# EAGLE schematic EVmulator_T85 (EAGLE 9.6.2)
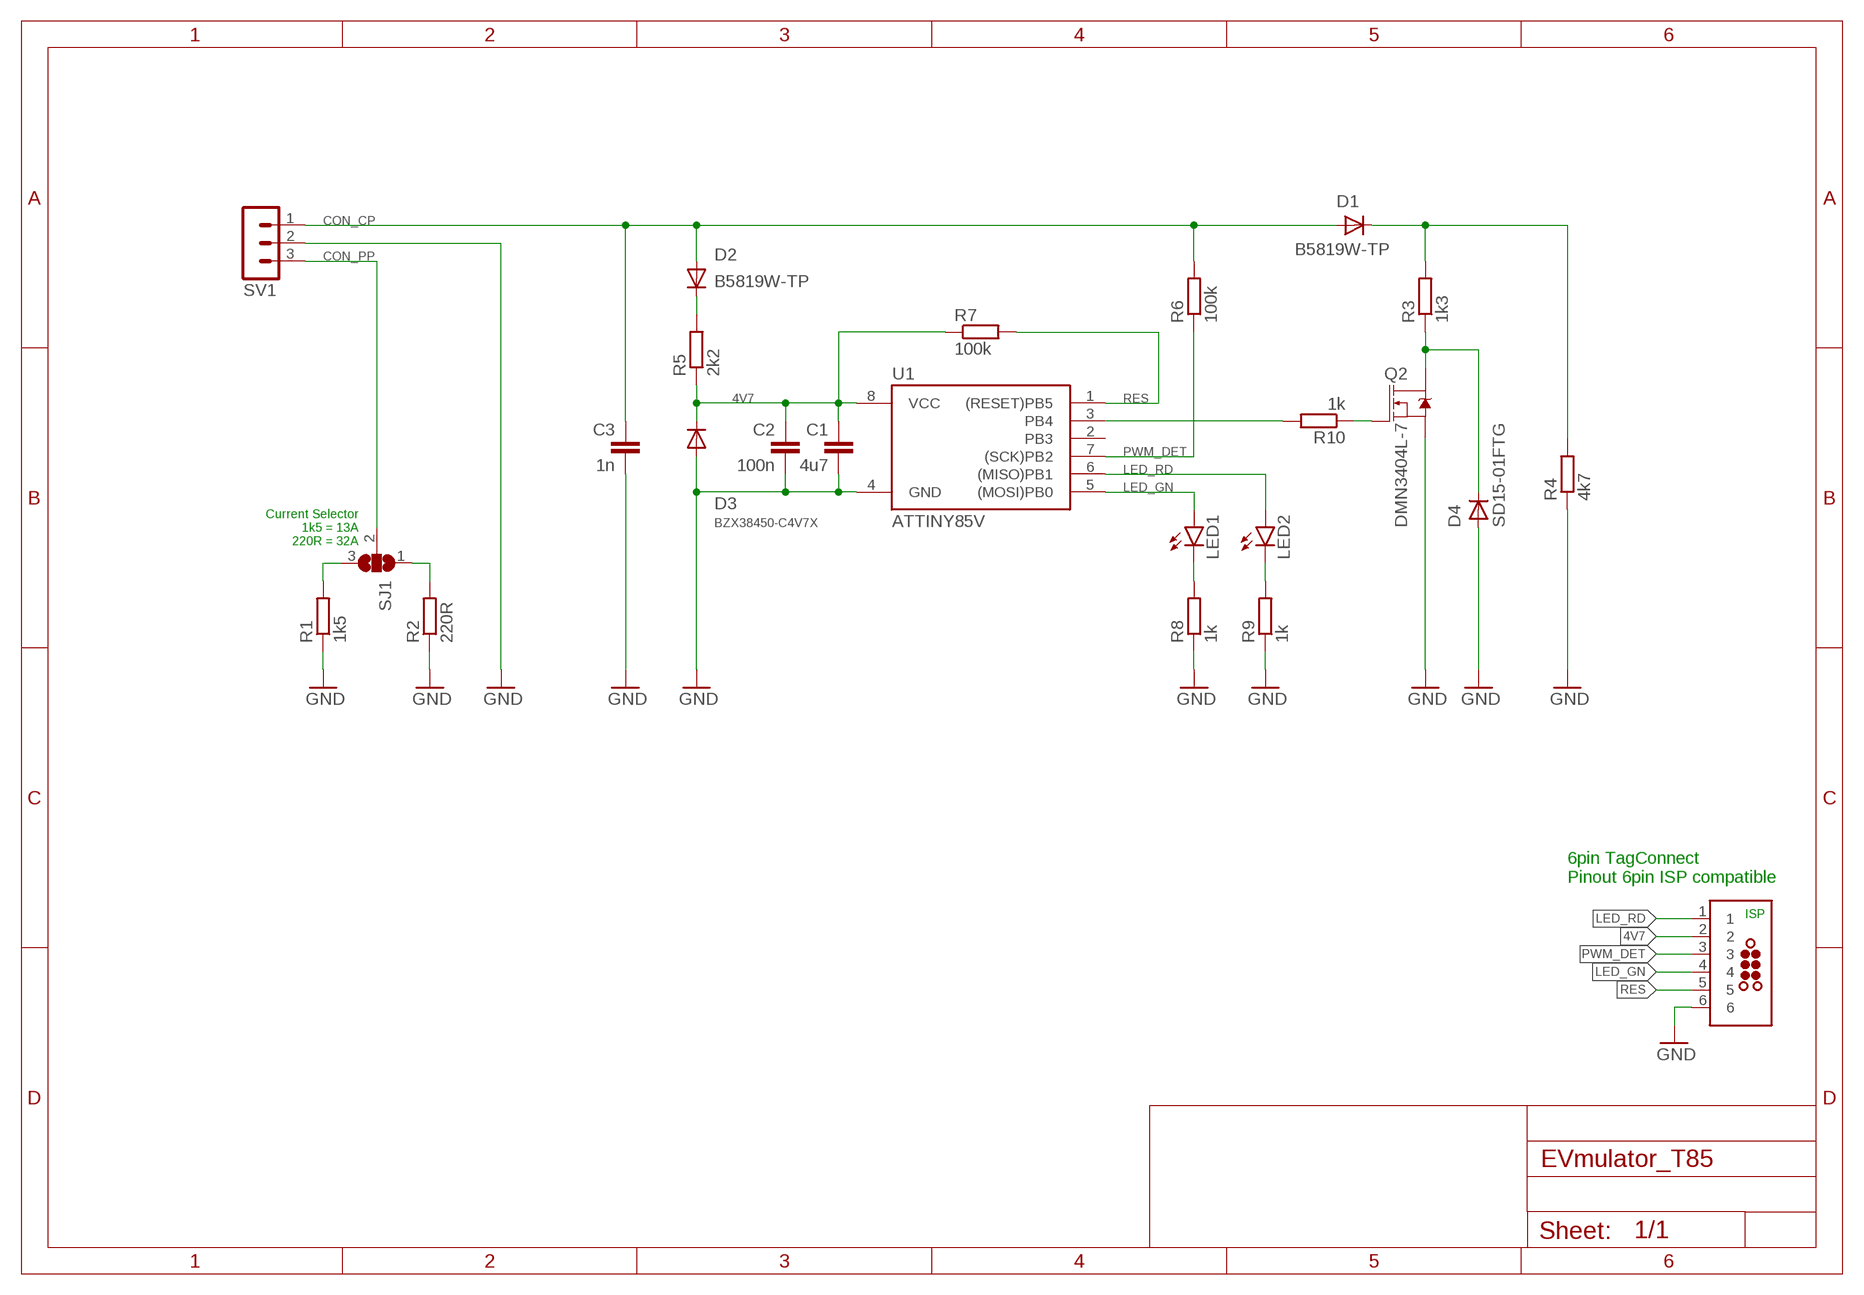
[diagram p0: schematic, sheet 1]

## Parts
C1  4u7  C-EUC0603  [C0603]
C2  100n  C-EUC0603  [C0603]
C3  1n  C-EUC0603  [C0603]
D1  B5819W-TP  DIODESOD-123  [SOD-123]
D2  B5819W-TP  DIODESOD-123  [SOD-123]
D3  BZX38450-C4V7X  DIODESOD-323F  [SOD-323F]
D4  SD15-01FTG  DIODESOD-323F  [SOD-323F]
J1  TAG-CONNECT_TC2030-MCP-NL  [TAG-CONNECT_TC2030-MCP-NL]
LED1  LEDCHIP-LED0603  [CHIP-LED0603]
LED2  LEDCHIP-LED0603  [CHIP-LED0603]
Q2  DMN3404L-7  MOSFET-NCH-AO3404A  [SOT23-3]
R1  1k5  R-EU_R0805  [R0805]
R2  220R  R-EU_R0805  [R0805]
R3  1k3  R-EU_R0603  [R0603]
R4  4k7  R-EU_R0603  [R0603]
R5  2k2  R-EU_R0603  [R0603]
R6  100k  R-EU_R0603  [R0603]
R7  100k  R-EU_R0603  [R0603]
R8  1k  R-EU_R0603  [R0603]
R9  1k  R-EU_R0603  [R0603]
R10  1k  R-EU_R0603  [R0603]
SJ1  SJ2W  [SJ_2]
SV1  MA03-1  [MA03-1]
U1  ATTINY85V  ATTINY25/45/85-20SU  [SOIC8]

## Nets
4V7: C1.1 C2.1 D3.C J1.2 R5.1 R7.1 U1.8(VCC)
CON_CP: C3.1 D1.A D2.A R6.2 SV1.1
CON_PP: SJ1.2 SV1.3
GND: C1.2 C2.2 C3.2 D3.A D4.A J1.6 Q2.2(S) R1.1 R2.1 R4.1 R8.1 R9.1 SV1.2 U1.4(GND)
LED_GN: J1.4 LED1.A U1.5((MOSI)PB0)
LED_RD: J1.1 LED2.A U1.6((MISO)PB1)
N$1: R1.2 SJ1.3
N$2: R2.2 SJ1.1
N$3: LED1.C R8.2
N$4: LED2.C R9.2
N$5: D4.C Q2.3(D) R3.1
N$6: D1.C R3.2 R4.2
N$7: D2.C R5.2
N$8: Q2.1(G) R10.1
N$10: R10.2 U1.3(PB4)
PWM_DET: J1.3 R6.1 U1.7((SCK)PB2)
RES: J1.5 R7.2 U1.1((RESET)PB5)
Unconnected: U1.2(PB3)

## Notes on the sheet
- Current Selector
  1k5 = 13A
  220R = 32A
- 6pin TagConnect
  Pinout 6pin ISP compatible
- ISP

## Library data of the parts
C1-C3 = rcl:C-EU: CAPACITOR, European symbol; SPICEPREFIX: C
D1-D4 = adafruit:DIODE: Diode SMADIODE - SMA Surface Mount Package 20V 1A Schottky Diode Digikey: 641-1014-6-ND DO-1N4148 - Through Hole Small Current Diode SOD-123 20V 1 A (.5mV Vf) Schottky Diode - Digikey: MBRX120TPMSCT-ND SOD-323 10V 570mA (.38mV Vf, 3ns) Schottky Diode - Digikey: ZLLS410CT-ND SOD-523 30V 30mA Schottky Diode (RB751S-40TE61) - Digikey: RB751S-40TE61CT-ND SOT23-R/W - SOT23 Package (R = Solder Paste/Reflow Ovens, W = Hand-Soldering) BAT54Film 40V 300mA - Digikey: 497-7162-1-ND
J1 = Eigene-Rietig:TAG-CONNECT_TC2030: TAG-CONNECT ICSP Connector Manufacturer: Tag-Connect <http://www.tag-connect.com> Cable for easy In-Circuit Serial Programming. Designed for Microchip ICD2, suitable for many others. Two variants - one "with legs" (for hands-free fit on PCB) and another "without legs" for quick programming. PAD Description 1 MCLR/Vpp 2 Vdd 3 GND 4 PGD (ISPDAT) 5 PGC (ISPCLK) 6 nc (used for LVP) ©2009 ROFA.cz - modified and updated by Robert Darlington ‹rdarlington@gmail.com›
LED1 LED2 = led:LED: LED OSRAM: - CHIPLED LG R971, LG N971, LY N971, LG Q971, LY Q971, LO R971, LY R971 LH N974, LH R974 LS Q976, LO Q976, LY Q976 LO Q996 - Hyper CHIPLED LW Q18S LB Q993, LB Q99A, LB R99A - SideLED LS A670, LO A670, LY A670, LG A670, LP A670 LB A673, LV A673, LT A673, LW A673 LH A674 LY A675 LS A676, LA A676, LO A676, LY A676, LW A676 LS A679, LY A679, LG A679 - Hyper Micro SIDELED® LS Y876, LA Y876, LO Y876, LY Y876 LT Y87S - SmartLED LW L88C, LW L88S LB L89C, LB L89S, LG L890 LS L89K, LO L89K, LY L89K LS L896, LA L896, LO L896, LY L896 - TOPLED LS T670, LO T670, LY T670, LG T670, LP T670 LSG T670, LSP T670, LSY T670, LOP T670, LYG T670 LG T671, LOG T671, LSG T671 LB T673, LV T673, LT T673, LW T673 LH T674 LS T676, LA T676, LO T676, LY T676, LB T676, LH T676, LSB T676, LW T676 LB T67C, LV T67C, LT T67C, LS T67K, LO T67K, LY T67K, LW E67C LS E67B, LA E67B, LO E67B, LY E67B, LB E67C, LV E67C, LT E67C LW T67C LS T679, LY T679, LG T679 LS T770, LO T770, LY T770, LG T770, LP T770 LB T773, LV T773, LT T773, LW T773 LH T774 LS E675, LA E675, LY E675, LS T675 LS T776, LA T776, LO T776, LY T776, LB T776 LHGB T686 LT T68C, LB T68C - Hyper Mini TOPLED® LB M676 - Mini TOPLED Santana® LG M470 LS M47K, LO M47K, LY M47K Source: http://www.osram.convergy.de LUXEON: - LUMILED® LXK2-PW12-R00, LXK2-PW12-S00, LXK2-PW14-U00, LXK2-PW14-V00 LXK2-PM12-R00, LXK2-PM12-S00, LXK2-PM14-U00 LXK2-PE12-Q00, LXK2-PE12-R00, LXK2-PE12-S00, LXK2-PE14-T00, LXK2-PE14-U00 LXK2-PB12-K00, LXK2-PB12-L00, LXK2-PB12-M00, LXK2-PB14-N00, LXK2-PB14-P00, LXK2-PB14-Q00 LXK2-PR12-L00, LXK2-PR12-M00, LXK2-PR14-Q00, LXK2-PR14-R00 LXK2-PD12-Q00, LXK2-PD12-R00, LXK2-PD12-S00 LXK2-PH12-R00, LXK2-PH12-S00 LXK2-PL12-P00, LXK2-PL12-Q00, LXK2-PL12-R00 Source: www.luxeon.com KINGBRIGHT: KA-3528ASYC Source: www.kingbright.com
Q2 = SparkFun-DiscreteSemi:MOSFET-NCH: N-channel MOSFETs Voltage controlled devices that allow control of high current outputs. SparkFun Products: SparkFun OpenScale <https://www.sparkfun.com/products/13261> SparkFun Digital Sandbox <https://www.sparkfun.com/products/12651> SparkFun Monster Moto Shield <https://www.sparkfun.com/products/10182> SparkFun MOSFET Power Controller <https://www.sparkfun.com/products/11214>; PROD_ID: TRANS-12988; VALUE: 5.8A/30V/35mΩ
R1-R10 = rcl:R-EU_: RESISTOR, European symbol; SPICEPREFIX: R
SJ1 = jumper:SJ2W: SMD solder JUMPER
SV1 = con-lstb:MA03-1: PIN HEADER; OC_FARNELL: unknown; OC_NEWARK: unknown
U1 = Eigene-Rietig:ATTINY25/45/85